# EAGLE board XOrduino2 (EAGLE 6.2)
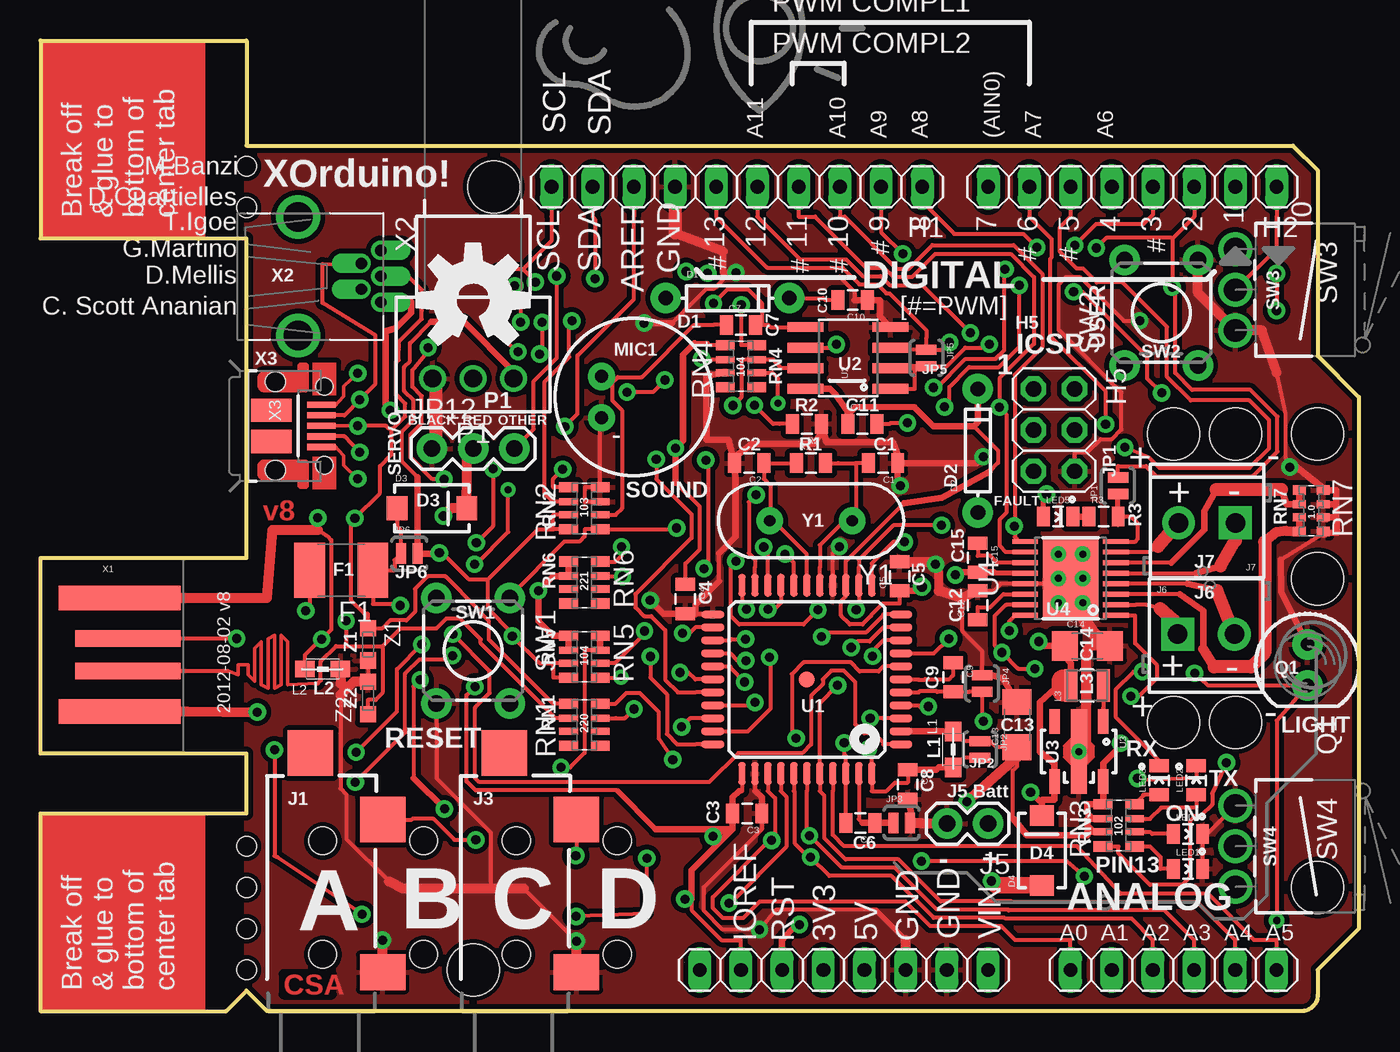
[diagram p2: board, top side]
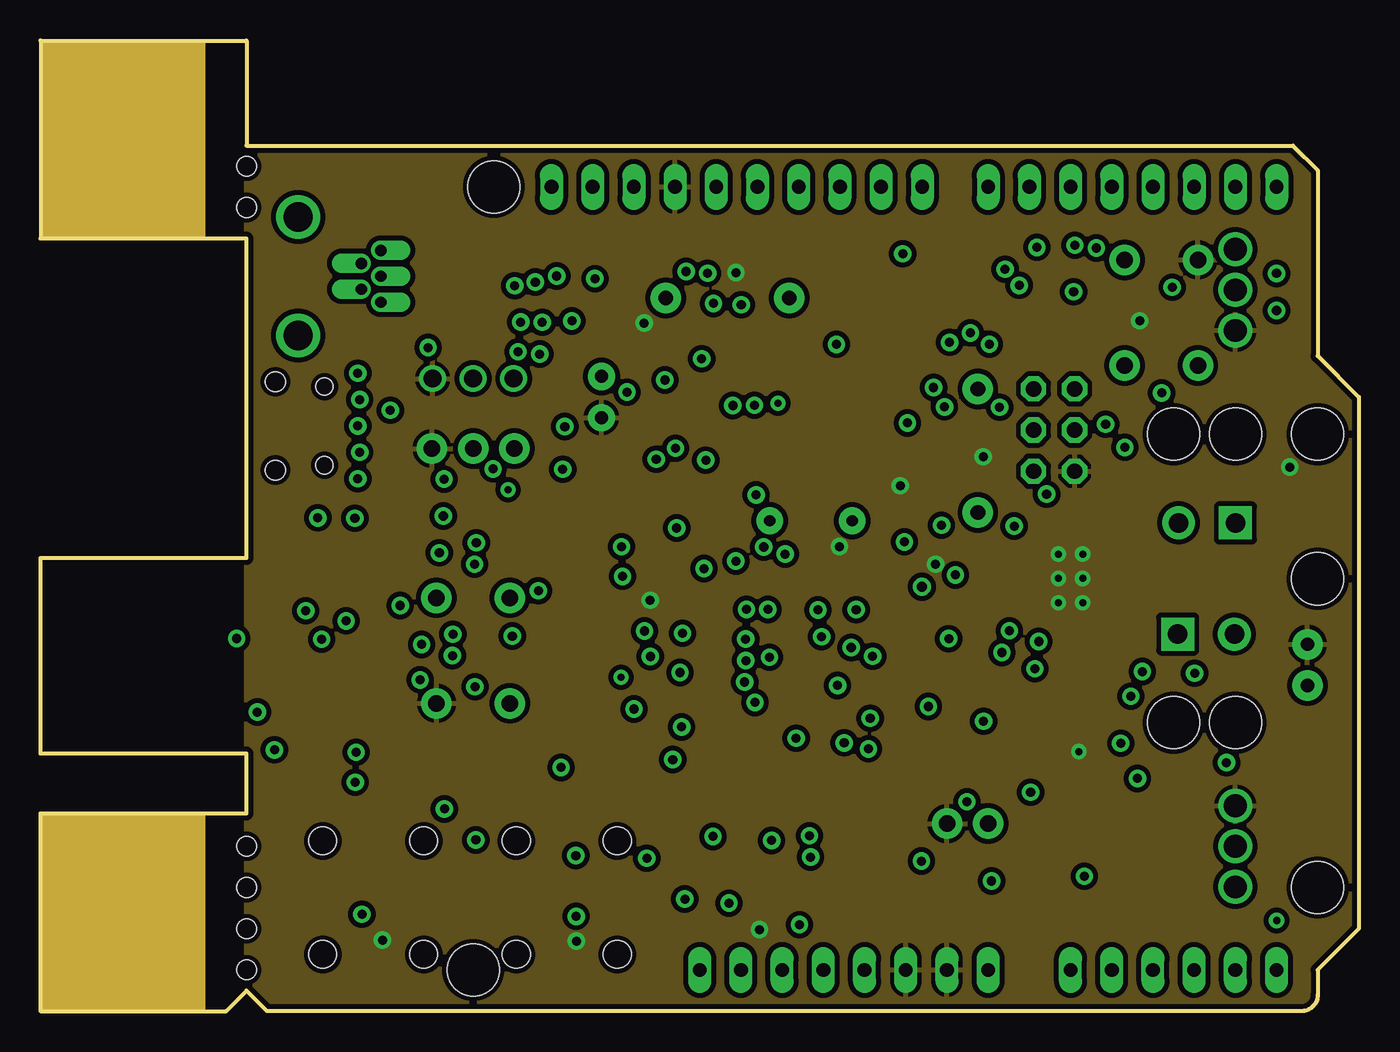
[diagram p3: board, inner layer Route2]
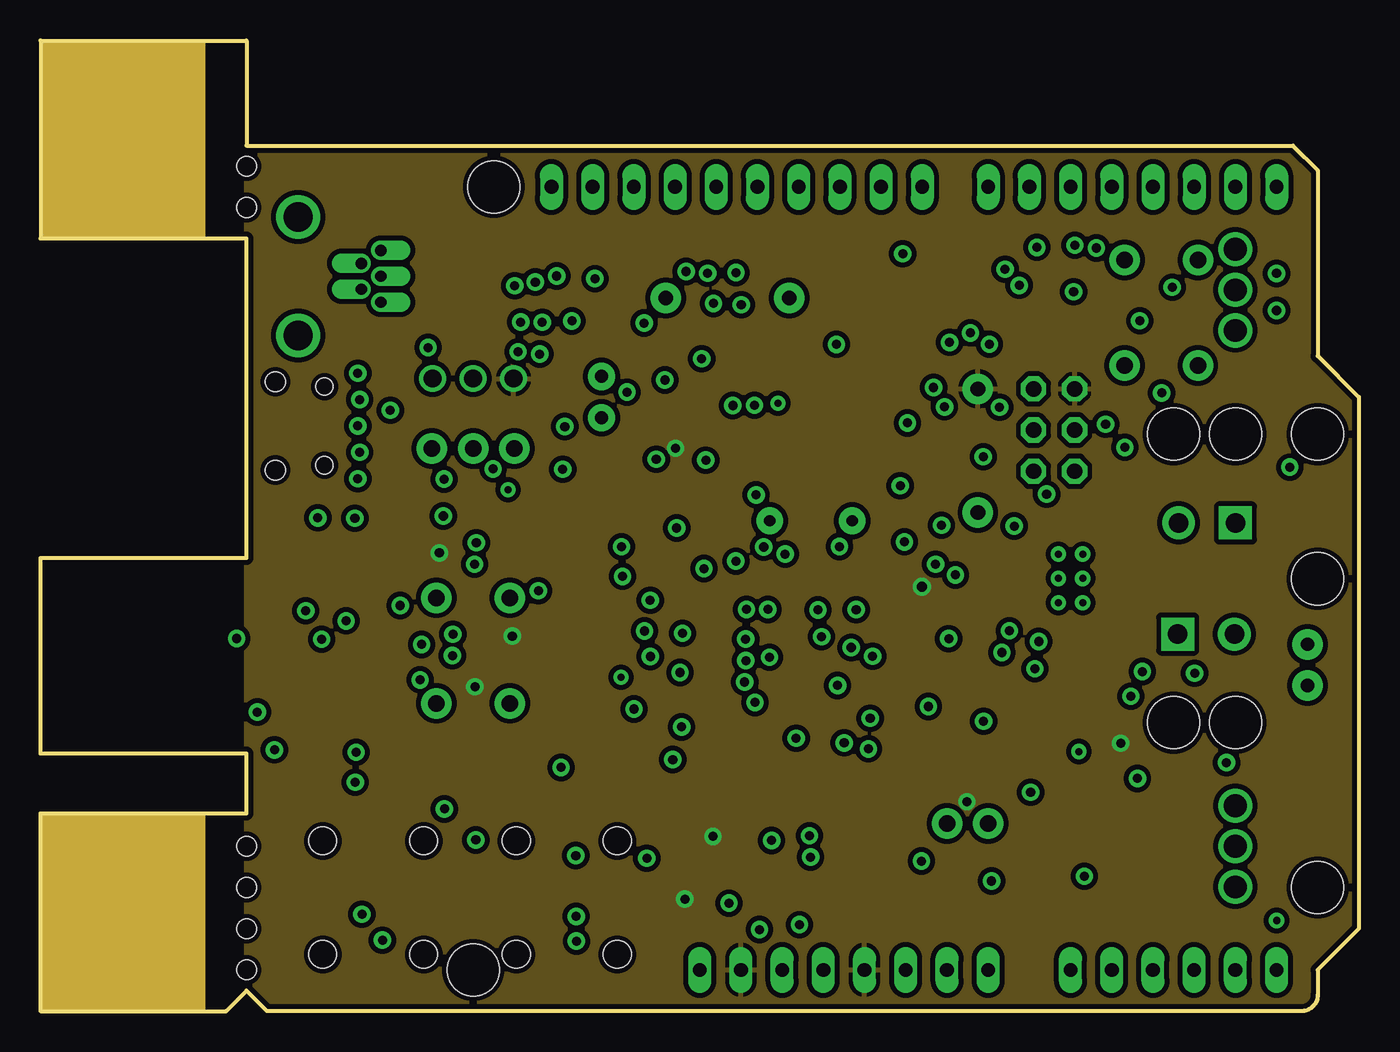
[diagram p4: board, inner layer Route15]
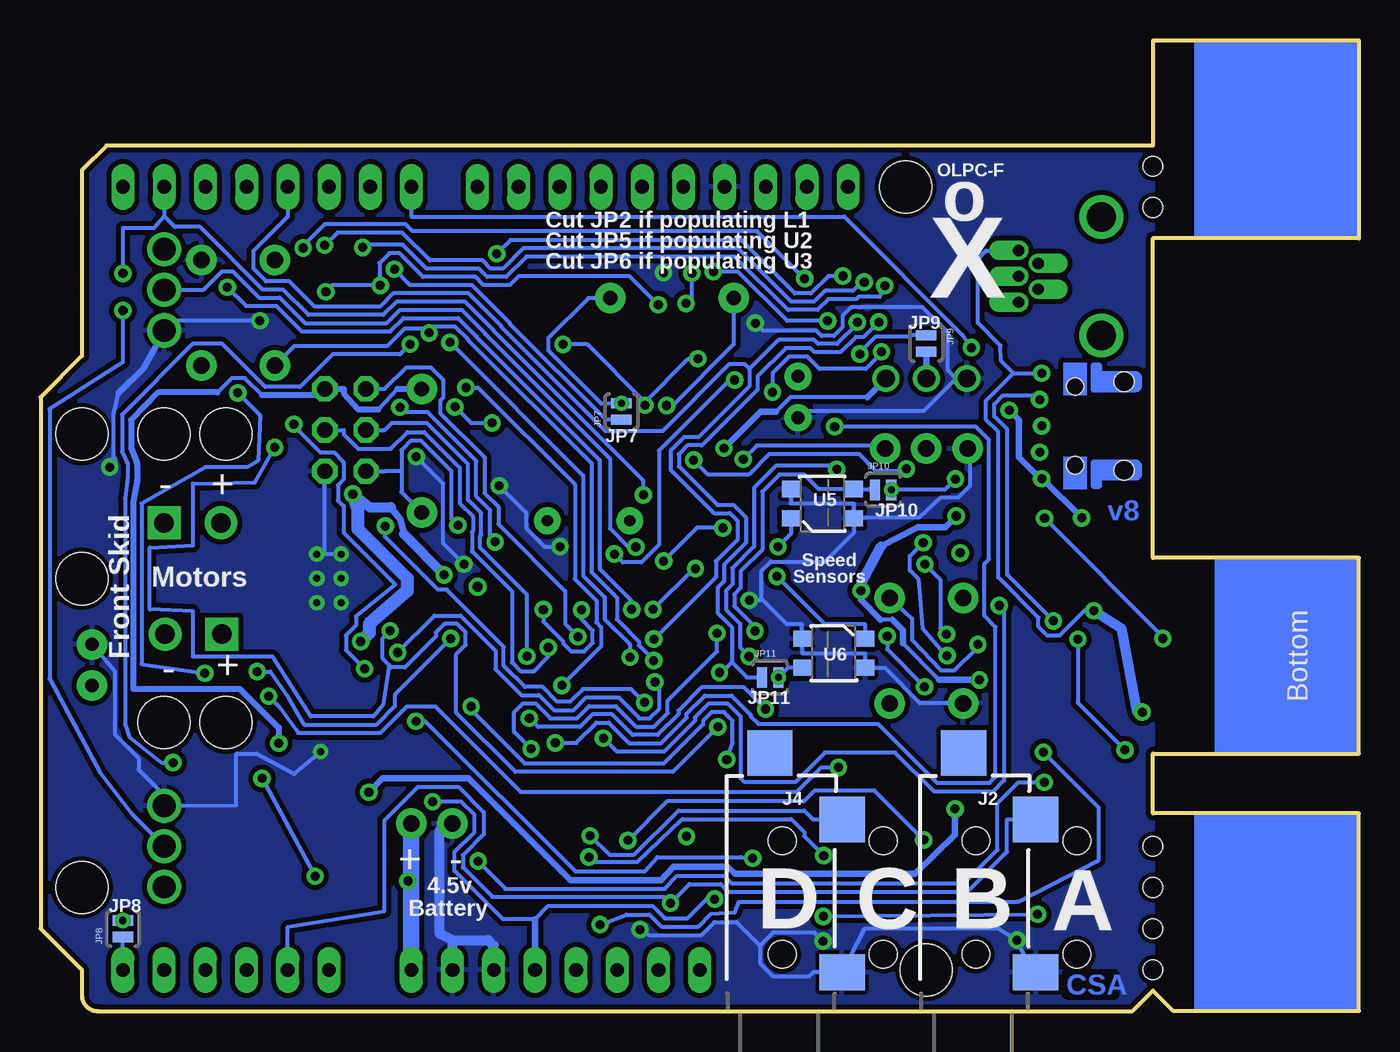
[diagram p5: board, bottom side, seen from below]

Size 81.28 x 59.82 mm. Coordinates in mm from the lower left corner, seen from the top.
Outline: 77.22,53.34 78.74,51.82 78.74,40.39 81.28,37.85 81.28,5.08 78.74,2.54 78.74,1 arc-90 77.74,0 13.97,0 12.7,1.27 11.43,0 0,0 0,12.19 12.7,12.19 12.7,15.88 0,15.88 0,27.94 12.7,27.94 12.7,47.62 0,47.62 0,59.82 12.7,59.82 12.7,53.34 77.22,53.34
Copper layers (1*2+15*16): Top 0.035mm / dielectric 0.2mm / Route2 0.035mm / dielectric 0.15mm / Route15 0.035mm / dielectric 0.2mm / Bottom 0.035mm
Design rules: minimum track width 8mil, minimum drill 20mil, track to track 8mil, track to pad 8mil, pad to pad 8mil, via to via 8mil, smd to smd 8mil, copper to edge 10mil, drill to drill 8mil, minimum pad ring 10mil, minimum via ring 10mil, stop-mask expansion 4mil, vias tented up to drill 25mil, thermal gap 10mil
Net classes: 0 default: width 0.203 mm, drill 0.406 mm, clearance 0.203 mm; 1 power: width 0.203 mm, drill 0.406 mm, clearance 0.203 mm; 2 gnd: width 0.203 mm, drill 0.406 mm, clearance 0.203 mm; 3 usbvcc: width 0.203 mm, drill 0.406 mm, clearance 0.203 mm; 4 aref: width 0.203 mm, drill 0.406 mm, clearance 0.203 mm
Holes 3.2 mm at 78.74,35.56 78.74,7.62 27.94,50.8 26.67,2.54 78.74,26.65 69.85,35.56 73.66,35.56 73.66,17.78 69.85,17.78
Holes 1.2 mm at 12.7,10.16 12.7,7.62 12.7,5.08 12.7,2.54 12.7,52.07 12.7,49.53

## Footprints (pad centres in the part's own frame; a part is rotated, then mirrored left to right if it is on the bottom)
0805 = smd 0.8 x 1.2: 1 -0.9,0; 2 0.9,0
1206 = smd 1.6 x 1.8: 1 -1.4,0; 2 1.4,0
DIODE-1N4148 = drill 0.9 pad 1.88: A -3.81,0; C 3.81,0
SMA-DIODE = smd 1.27 x 1.47: A -2.15,0; C 2.15,0
L1812 = smd 1.9 x 3.4: 1 -1.95,0; 2 1.95,0
1X10 = drill 0.85 pad 1.422 long: 1 -11.43,0; 2 -8.89,0; 3 -6.35,0; 4 -3.81,0; 5 -1.27,0; 6 1.27,0; 7 3.81,0; 8 6.35,0; 9 8.89,0; 10 11.43,0
1X08 = drill 0.85 pad 1.422 long: 1 -8.89,0; 2 -6.35,0; 3 -3.81,0; 4 -1.27,0; 5 1.27,0; 6 3.81,0; 7 6.35,0; 8 8.89,0
1X06 = drill 0.85 pad 1.422 long: 1 -6.35,0; 2 -3.81,0; 3 -1.27,0; 4 1.27,0; 5 3.81,0; 6 6.35,0
2X03 = drill 0.95 pad 1.55 octagon: 1 -2.54,-1.27; 2 -2.54,1.27; 3 0,-1.27; 4 0,1.27; 5 2.54,-1.27; 6 2.54,1.27
MJ-3523-SMT = smd 2.2 x 2.8: 1 2.4,-3.7 | smd 2.8 x 2.8: 2 11.8,-3.7; 10 15.9,0.75 | hole 1.7: 3.5,0; 10.5,0
1X02 = drill 1.016 pad 1.88: 1 0,0; 2 2.54,0
SCREWTERMINAL-3.5MM-2 = drill 1.2 pad 2.032 square: 1 0,0 | drill 1.2 pad 2.032: 2 3.5,0
SJ-2S-TRACE-NOCONFLICT = smd 0.635 x 1.27: 1 -0.508,0; 2 0.508,0
SJ-2S-BOT-TRACE-VIA-NOCONFLICT = smd 0.635 x 1.27 bottom: 1 -0.508,0; 2 0.508,0 | drill 0.432: VIA6 -0.508,0
SJ-2S-BOT-TRACE-NOCONFLICT = smd 0.635 x 1.27 bottom: 1 -0.508,0; 2 0.508,0
1X03 = drill 1.016 pad 1.88: 1 0,0; 2 2.54,0; 3 5.08,0
0805' = smd 1.2 x 1: 1 -1.1,0; 2 1.1,0
1007 = smd 2 x 0.8: 1 0,1; 2 0,-1
LED0805 = smd 0.8 x 1.2: A -0.9,0; C 0.9,0
MIC-9.7MM = drill 0.8 pad 1.676: 1 -2,1.27; 2 -2,-1.27
P091N = drill 1.1: 1 -2.5,0; 2 0,0; 3 2.5,0
LED3MM-KIT = drill 0.813 pad 1.88: A -1.27,0; K 1.27,0
CRA06S = smd 0.63 x 1.15: 1 -1.295,-0.975; 4 1.295,-0.975; 5 1.295,0.975; 8 -1.295,0.975 | smd 0.44 x 1.15: 2 -0.4,-0.975; 3 0.4,-0.975; 6 0.4,0.975; 7 -0.4,0.975
EXB38V = smd 0.6 x 0.8: 1 -1.275,-0.75; 4 1.275,-0.75; 5 1.275,0.75; 8 -1.275,0.75 | smd 0.5 x 0.8: 2 -0.4,-0.75; 3 0.4,-0.75; 6 0.4,0.75; 7 -0.4,0.75
TACTILE-PTH = drill 1.016 pad 1.88: 1 -3.251,2.261; 2 3.251,2.261; 3 -3.251,-2.261; 4 3.251,-2.261
SW-LEVER-V1-NOHOLES = drill 1.4: C 2.5,0; NC -2.5,0; NO 0,0
SW-LEVER-V2-NOHOLES = drill 1.4: C -2.5,0; NC 2.5,0; NO 0,0
TQFP44-PAD = smd 1.4 x 0.45: 1 -5.8,4; 2 -5.8,3.2; 3 -5.8,2.4; 4 -5.8,1.6; 5 -5.8,0.8; 6 -5.8,0; 7 -5.8,-0.8; 8 -5.8,-1.6; 9 -5.8,-2.4; 10 -5.8,-3.2; 11 -5.8,-4; 23 5.8,-4; 24 5.8,-3.2; 25 5.8,-2.4; 26 5.8,-1.6; 27 5.8,-0.8; 28 5.8,0; 29 5.8,0.8; 30 5.8,1.6; 31 5.8,2.4; 32 5.8,3.2; 33 5.8,4 | smd 0.45 x 1.4: 12 -4,-5.8; 13 -3.2,-5.8; 14 -2.4,-5.8; 15 -1.6,-5.8; 16 -0.8,-5.8; 17 0,-5.8; 18 0.8,-5.8; 19 1.6,-5.8; 20 2.4,-5.8; 21 3.2,-5.8; 22 4,-5.8; 34 4,5.8; 35 3.2,5.8; 36 2.4,5.8; 37 1.6,5.8; 38 0.8,5.8; 39 0,5.8; 40 -0.8,5.8; 41 -1.6,5.8; 42 -2.4,5.8; 43 -3.2,5.8; 44 -4,5.8 | smd 1 x 1: P$1 0,0
SO08 = smd 0.61 x 2.21: 1 -1.905,-2.616; 2 -0.635,-2.616; 3 0.635,-2.616; 4 1.905,-2.616; 5 1.905,2.616; 6 0.635,2.616; 7 -0.635,2.616; 8 -1.905,2.616
SOT89-5 = smd 0.65 x 1.5: 1 -1.5,-1.85; 3 1.5,-1.85; 4 1.5,1.85; 5 -1.5,1.85 | smd 1 x 5.2: 2 0,0 | drill 0.432: VIA1 0,0
PWP16 = smd 0.3 x 1.6: 1 -2.275,-2.8; 2 -1.625,-2.8; 3 -0.975,-2.8; 4 -0.325,-2.8; 5 0.325,-2.8; 6 0.975,-2.8; 7 1.625,-2.8; 8 2.275,-2.8; 9 2.275,2.8; 10 1.625,2.8; 11 0.975,2.8; 12 0.325,2.8; 13 -0.325,2.8; 14 -0.975,2.8; 15 -1.625,2.8; 16 -2.275,2.8 | smd 5 x 3.4: PPAD 0,0 | drill 0.432: VIA1 -1.5,-0.75; VIA2 0,-0.75; VIA3 1.5,-0.75; VIA4 1.5,0.75; VIA5 0,0.75; VIA6 -1.5,0.75
QRE1113GR = smd 1.1 x 1: 1 -1.95,-0.9; 2 1.95,-0.9; 3 1.95,0.9; 4 -1.95,0.9
USB-A-PCB = smd 7.5 x 1.5: 5V -0.2,-3.5; GND -0.2,3.5 | smd 6.5 x 1: USB_M 0.3,-1; USB_P 0.3,1
USB-MB-H2 = drill 0.7 pad 1.1 offset: D+ 5.1,0; D- 3.9,0.8; GND 5.1,-1.6; ID 3.9,-0.8; VBUS 5.1,1.6 | drill 1.8 pad 2.7: P$6 0,-3.65; P$7 0,3.65
USB-MICROB-VIA = smd 0.375 x 1.75: D+ 0,2.825; D- -0.65,2.825; GND 1.3,2.825; ID 0.65,2.825; VBUS -1.3,2.825 | drill 0.559 pad 1.067: D+_VIA 0,5.08; D-_VIA -1.626,5.2; GND_VIA 3.251,5.08; ID_VIA 1.626,5.2; VBUS_VIA -3.251,5.08 | smd 1.425 x 2.5: MT1 -0.963,-0.25; MT2 0.963,-0.25 | hole 1.05: -2.425,3.03; 2.425,3.03 | hole 1.2: -2.725,0; 2.725,0
HC49US = drill 0.7 pad 1.651: 1 -2.54,0; 2 2.54,0
CT/CN0603 = smd 1 x 1: 1 -1,0; 2 1,0

## Placement (x,y rotation side)
C1  18p  [0805]  51.94,33.78 180 top
C2  18p  [0805]  43.69,33.78 180 top
C3  100n  [0805]  43.56,12.19 180 top
C4  100n  [0805]  39.75,25.4 270 top
C5  100n  [0805]  52.96,26.8 90 top
C6  100n  [0805]  50.55,11.61 180 top
C7  100n  [0805]  43.18,42.29 0 top
C8  1uF  [0805]  53.47,13.97 270 top
C9  1uF  [0805]  56.26,20.57 270 top
C10  0.22uF  [0805]  50.07,43.81 180 top
C11  0.33uF  [0805]  50.67,36.2 0 top
C12  10uF  [0805]  57.78,25.02 90 top
C13  22uF  [1206]  60.2,17.65 90 top
C14  22uF  [1206]  64.54,22.51 0 top
C15  0.01uF  [0805]  57.78,27.94 270 top
D1  1N4148  [DIODE-1N4148]  42.35,43.94 0 top
D2  1N4148  [DIODE-1N4148]  57.78,34.54 90 top
D3  1A Schottkey  [SMA-DIODE]  24.13,30.99 0 top
D4  1A Schottkey  [SMA-DIODE]  61.72,9.91 90 top
F1  0ZCC0110FF2C 1.1A  [L1812]  18.54,27.18 180 top
H1  10x1F-H8.5  [1X10]  42.93,50.8 180 top
H2  8x1F-H8.5  [1X08]  67.31,50.8 180 top
H3  8x1F-H8.5  [1X08]  49.53,2.54 0 top
H4  6x1F-H8.5  [1X06]  69.85,2.54 0 top
H5  ICSP  [2X03]  62.48,35.81 270 top
J1  2.5mm  [MJ-3523-SMT]  17.4,0 90 top
J2  2.5mm  [MJ-3523-SMT]  23.62,0 90 bottom
J3  2.5mm  [MJ-3523-SMT]  29.34,0 90 top
J4  2.5mm  [MJ-3523-SMT]  35.56,0 90 bottom
J5  Batt In  [1X02]  58.42,11.56 180 top
J6  MOT R  [SCREWTERMINAL-3.5MM-2]  70.1,23.24 0 top
J7  MOT L  [SCREWTERMINAL-3.5MM-2]  73.66,30.1 180 top
JP1  N/C  [SJ-2S-TRACE-NOCONFLICT]  66.42,32.38 90 top
JP2  N/C  [SJ-2S-TRACE-NOCONFLICT]  57.91,16.13 270 top
JP3  N/C  [SJ-2S-TRACE-NOCONFLICT]  53.09,11.61 0 top
JP4  N/C  [SJ-2S-TRACE-NOCONFLICT]  58.04,20.19 270 top
JP5  N/C  [SJ-2S-TRACE-NOCONFLICT]  54.61,40.26 270 top
JP6  N/C  [SJ-2S-TRACE-NOCONFLICT]  22.73,28.19 0 top
JP7  N/C  [SJ-2S-BOT-TRACE-VIA-NOCONFLICT]  45.47,36.96 270 top
JP8  N/C  [SJ-2S-BOT-TRACE-VIA-NOCONFLICT]  76.2,5.08 270 top
JP9  N/C  [SJ-2S-BOT-TRACE-NOCONFLICT]  26.67,41.15 90 top
JP10  N/C  [SJ-2S-BOT-TRACE-VIA-NOCONFLICT]  29.34,32.13 0 top
JP11  N/C  [SJ-2S-BOT-TRACE-VIA-NOCONFLICT]  36.3,20.57 0 top
JP12  SERVO  [1X03]  24.13,34.67 0 top
L1  MH2029-300Y  [0805']  56.26,16.13 270 top
L2  MH2029-300Y  [0805']  17.4,21.08 0 top
L3  100uH  [1007]  64.52,20.07 90 top
LED1  L Yellow  [LED0805]  70.74,8.76 0 top
LED2  TX Red  [LED0805]  71.25,14.22 90 top
LED3  RX Red  [LED0805]  68.96,14.22 90 top
LED4  ON Green  [LED0805]  70.74,10.92 0 top
LED5  FAULT Red  [LED0805]  62.73,30.47 0 top
MIC1  MIC9.7MM  [MIC-9.7MM]  36.58,37.85 0 top
P1  10k  [P091N]  26.67,38.99 180 top
Q1  ALS-PT204-6C/L177  [LED3MM-KIT]  78.11,21.34 270 top
R1  1M  [0805]  47.5,33.78 0 top
R2  2.2k  [0805]  47.24,36.2 180 top
R3  1k  [0805]  65.53,30.48 0 top
RN1  22  [CRA06S]  33.53,17.65 90 top
RN2  10k  [CRA06S]  33.53,30.99 90 top
RN3  1k  [CRA06S]  66.47,11.45 90 top
RN4  100k  [CRA06S]  43.18,39.75 90 top
RN5  100k  [CRA06S]  33.53,21.84 270 top
RN6  220  [CRA06S]  33.53,26.42 270 top
RN7  1ohm 1/16W  [EXB38V]  78.34,30.84 270 top
SW1  RESET  [TACTILE-PTH]  26.67,22.23 270 top
SW2  6mm Button  [TACTILE-PTH]  69.09,43.05 90 top
SW3  LEFT BUMPER  [SW-LEVER-V1-NOHOLES]  73.66,44.45 270 top
SW4  RIGHT BUMPER  [SW-LEVER-V2-NOHOLES]  73.66,10.16 270 top
U1  ATMEGA32U4-XUAU  [TQFP44-PAD]  47.24,20.45 180 top
U2  LMV358  [SO08]  49.78,40.26 90 top
U3  NJU7261  [SOT89-5]  64.01,16 180 top
U4  DRV8833PWP  [PWP16]  63.5,26.67 90 top
U5  QRE1113GR  [QRE1113GR]  33.08,31.28 0 bottom
U6  QRE1113GR  [QRE1113GR]  32.38,22.06 180 bottom
U$5  OSHW-LOGOL  [OSHW-LOGO-L]  26.67,43.81 0 top
X1  USBPCB  [USB-A-PCB]  5.08,21.97 0 top
X2  USBMINIB  [USB-MB-H2]  15.88,45.29 0 top
X3  USBMICROB-VIA  [USB-MICROB-VIA]  14.48,36.07 270 top
Y1  16MHz  [HC49US]  47.5,30.23 180 top
Z1  CG0603MLC-05E  [CT/CN0603]  20.19,22.61 270 top
Z2  CG0603MLC-05E  [CT/CN0603]  20.19,19.3 90 top

## Tracks (layer width: path | path; a pad name or v marks a point on that pad's centre or on a via)
+5V  (via drill 0.56 pad 1.07, 0.6)
  Top 0.254: 23.24,32.9 22.29,33.85 22.29,35.75 22.99,36.45 22.99,37.65 22.42,38.22 22.42,39.71 22.77,40.07 22.77,41.17 24.09,42.49 | 40.14,6.91 40.14,6.23 41.99,4.38 43.18,4.38 H3.2 | 57.54,36.05 59.03,34.56 59.03,33.79 58.5,33.25 | 53.24,31.29 49.64,27.73 U1.14 49.64,25.56 49.35,25.26 49.35,24.38 49.89,23.83 50.67,23.83 51.2,24.36 51.2,24.41 51.91,25.12 52.96,25.12 C5.1 | 59.94,11.9 59.94,14.82 60.2,15.07 60.2,15.65 C13.1 58.92,16.25 58.53,16.64 JP2.1 56.9,16.64 56.39,17.14 | L1.1 56.3,17.23 56.39,17.14 | 43.05,13.57 43.24,13.57 U1.34 | 31.6,29.69 31.6,30.59 RN2.7 | RN2.8 31.6,29.69 | RN3.7 65.02,11.05 64.94,11.05 | 64.88,11.85 RN3.6 | RN4.5 41.25,41.05 41.13,41.16 40.33,41.16 | C4.1 39.75,27.58 40.65,28.48 40.65,31.08 39.15,32.58 | 65.51,13.62 U3.5 | 56.39,17.14 55.73,17.14 55.63,17.25 | RN5.3 31.6,21.44 | 31.6,21.44 30.76,21.44 v29.08,23.12 29.08,23.31 27.6,24.79 27.6,26.63 | 31.6,21.44 31.6,20.55 RN5.4 | 24.81,28.19 26.38,26.63 27.6,26.63 | 27.6,26.63 30.66,29.69 31.6,29.69 | 35.53,13.6 26.83,13.6 26.26,14.17 26.26,19.48 v26.78,20
  Top 0.305: 37.92,11.21 35.53,13.6 | 24.81,28.19 v24.59,28.25
  Top 0.356: 55.06,36.05 53.88,37.23 50.24,37.23 49.79,36.78
  Top 0.406: 23.24,32.9 JP6.2 24.81,28.19 | 24.09,42.49 26.1,42.49 29.17,39.42 P1.1 | 42.66,11.21 40.14,8.69 40.14,6.91 v39.72,6.91 | 58.5,33.25 55.58,31.63 53.24,31.29 | 59.94,11.9 60.8,10.84 64.53,10.84 64.54,11.05 65.02,11.05 | 43.05,13.57 42.66,13.17 C3.2 42.66,11.21 | 64.94,11.05 64.54,11.45 64.54,11.85 64.88,11.85 64.54,12.19 64.54,12.74 RN3.5 65.51,13.02 65.51,13.62 | U2.8 48.65,38.35 48.99,38.02 49.75,36.96 C11.1 49.79,36.7 49.79,36.78 | U3.5 65.51,15.28 66.59,16.37 v66.59,16.51 | 55.63,17.25 U1.2 | D2.C 57.78,36.29 57.54,36.05 55.06,36.05 | 40.33,41.16 39.61,40.44 39.61,35.16 v39.15,34.7 39.15,32.58 | 42.66,11.21 42.27,11.21 | 42.27,11.21 37.92,11.21 | v41.45,10.77 42.27,11.21 | v54.33,26.16 54.36,25.91 52.83,25.91
  Top 0.61: v57.11,12.91 60.2,15.65
  Bottom 0.254: v39.72,6.91 40.22,6.91 41.41,5.72 42.79,5.72 43.56,6.49 49.98,6.49 50.8,5.67 52.78,5.67 55.76,8.65 55.76,9.81 54.53,11.03 54.53,12.1 55.35,12.91 v57.11,12.91 | v57.11,12.91 | 67.63,37.96 68.68,39.01 69.49,39.01 70.37,38.14 | 60.45,37.08 59.28,38.35 | v29.08,23.12 29.08,22.3 v26.78,20 | 30.31,37.85 35.04,37.85 35.93,36.95
  Bottom 0.356: 67.63,37.96 64.14,37.96 H5.2 62.59,38.35 62.59,38.08 61.7,37.08 60.45,37.08 | 70.37,38.14 74.03,38.14 75.69,36.42 75.69,34.7 75.34,33.73 75.34,32.72 75.56,31.39 75.56,19.86 69,19.86 66.59,17.48 v66.59,16.51 | 59.28,38.35 D2.C
  Bottom 0.406: H3.5 50.8,5.67 | P1.1 30.31,37.85 | 35.93,36.95 36.89,36.95 v39.15,34.7
  pour Route15 (isolate 0.305): 12.7,1.27 12.7,52.07 13.97,53.34 77.47,53.34 78.74,52.07 78.74,40.64 81.28,38.1 81.28,5.08 78.74,2.54 78.74,1.27 77.47,0 15.24,0
A0  (via drill 0.56 pad 1.07)
  Top 0.254: J1.2 22.88,11.8 22.96,11.88 24.19,11.88 25.52,10.55 v26.84,10.55 | U1.36 44.84,13.57 45.28,13.13 45.28,10.73 v45.07,10.52 44.94,10.52 41.45,7.04 41.45,6.35 42.06,5.74 43.31,5.74 44.32,6.75 53.34,6.75 54.85,5.24 59.23,5.24 60.09,4.38 63.5,4.38 H4.1
  Bottom 0.254: v26.84,10.55 29.87,13.59 33.56,13.59 34.22,12.92 42.66,12.92 v45.07,10.51 v45.07,10.52
A1  (via drill 0.56 pad 1.07)
  Top 0.254: v42.44,6.66 42.52,6.66 45.98,10.12 45.98,13.22 45.64,13.57 U1.37
  Bottom 0.254: J2.2 21.7,11.8 21.7,9.82 24.14,7.37 38.89,7.37 39.34,7.82 41.27,7.82 v42.44,6.66 42.83,7.05 53.43,7.05 55.23,8.86 55.23,9.61 53.96,10.89 53.96,12.26 55.52,13.82 58.02,13.82 60.07,11.76 60.07,6.17 66.04,5.19 H4.2
A2  (via drill 0.56 pad 1.07)
  Top 0.254: H4.3 68.58,4.38 67.26,5.7 59.49,5.7 59.44,5.75 55.06,5.75 52.47,8.34 48.63,8.34 v47.47,9.49 47.35,9.49 46.49,10.36 46.49,13.52 46.44,13.57 U1.38 | v33,9.59 33,9.98 33.04,10.02 J3.2
  Bottom 0.254: v47.47,9.49 47.07,9.2 44.48,9.2 41.73,11.84 34.99,11.84 34.19,11.04 34.19,10.78 v33,9.59
A3  (via drill 0.56 pad 1.07)
  Top 0.254: H4.4 71.12,4.38 69.29,6.21 59.7,6.21 59.65,6.25 55.27,6.25 52.68,8.85 49.42,8.85 47.45,10.82 v47.41,10.82 47.24,10.98 47.24,13.57 U1.39
  Bottom 0.254: J4.2 33.64,11.8 34.2,12.35 41.94,12.35 44.68,9.65 46.2,9.65 v47.41,10.82
A4  (via drill 0.56 pad 1.07)
  Top 0.254: v49.14,20.07 48.04,18.98 48.04,15.73 U1.40 48.04,13.57 48.32,13.29 48.32,10.66 49.63,9.35 52.89,9.35 55.48,6.76 59.86,6.76 59.91,6.72 71.32,6.72 73.66,4.38 H4.5 | v55.06,38.44 55.27,38.44 57.03,40.19 58.88,40.19 59.41,40.73 59.41,45.68 v59.47,45.73
  Bottom 0.254: v55.06,38.44 | v55.06,38.44 54.32,38.44 48.34,32.46 48.34,26.63 47.02,25.31 47.02,23.96 46.73,23.67 46.73,22.48 v49.14,20.07 | JP7.2 46.43,36.45 52.35,42.37 52.35,42.42 54.69,44.75 58.49,44.75 v59.47,45.73
A5
  Top 0.254: H4.6 76.2,4.38 74.82,4.38 71.98,7.22 66.59,7.22 63.9,10.17 49.54,10.17 48.84,10.86 48.84,13.57 U1.41
  Bottom 0.254: H4.6 JP8.2
AGND
  Top 0.254: U1.43 50.44,11.83 50.66,11.61
  Top 0.406: 50.66,11.61 C6.1 JP3.1
AREF  (via drill 0.56 pad 1.07)
  Top 0.254: v49.55,16.54 49.55,15.83 49.64,15.73 U1.42 49.64,12.59 49.65,12.59 C6.2 | v32.32,36.03 33.1,36.81 33.1,40.41 36.58,43.88 36.58,48.96 H1.8
  Bottom 0.254: v49.55,16.54 48.26,16.54 47.01,17.79 46.25,17.79 44.99,16.53 43.02,16.53 41.45,18.1 41.45,18.32 40.32,19.45 38.67,19.45 37.51,18.28 37.51,18.18 37.03,17.7 29.64,17.7 26.01,14.07 22.77,14.07 22.41,14.44 22.41,23.68 23.09,24.35 23.09,27.57 22.8,27.86 22.8,35.22 23.62,36.03 v32.32,36.03
AVCC  (via drill 0.56 pad 1.07)
  Top 0.254: v51.04,16.17 51.04,15.93 51.24,15.73 U1.44 51.24,14.12 51.24,13.57 52.16,13.57 52.69,14.09 53.47,14.09 C8.1 | v39.58,23.29 40.01,23.29 40.36,23.65 U1.24 | L1.2 56.3,15.03 56.9,15.62 57.73,15.62 JP2.2
  Top 0.406: L1.2 55.38,15.03 55.22,14.87 54.45,14.87 C8.1
  Bottom 0.254: v51.04,16.17 52.09,17.22 52.09,18.41 51.53,18.97 50.77,18.97 49.84,18.04 48.22,18.04 47.46,18.8 45.83,18.8 44.57,17.54 43.45,17.54 42.62,18.37 42.62,19.12 39.58,22.17 v39.58,23.29
D0/RX  (via drill 0.56 pad 1.07)
  Top 0.254: v44.58,28.61 44.84,28.34 44.84,27.33 U1.20 | SW3.NO 76.2,46.99 76.2,48.96 H2.1
  Bottom 0.254: SW3.NO 71.23,44.45 70.08,45.6 69.43,45.6 67.8,43.97 66.54,43.97 64.97,42.4 59.94,42.4 59.11,43.23 55.32,43.23 53.88,41.78 53.88,41.74 46.19,34.05 46.19,29.75 45.05,28.61 v44.58,28.61
D1/TX  (via drill 0.56 pad 1.07)
  Top 0.254: v44.11,31.82 43.67,31.37 43.67,28.23 44.04,27.85 44.04,27.33 U1.21 | v76.2,45.47 v76.2,43.18
  Bottom 0.254: v44.11,31.82 44.11,32.7 53.37,41.95 53.37,41.99 55.11,43.73 59.32,43.73 60.15,42.91 64.76,42.91 66.33,44.48 67.58,44.48 71.45,48.34 73.01,48.34 | 73.01,48.34 | 73.01,48.34 73.66,48.99 | 73.66,48.99 74.3,48.26 76.2,48.26 v76.2,45.47 | SW4.NO 75.58,12.08 77.65,14.75 80.72,20.48 80.72,37.12 76.2,40.01 v76.2,43.18 | H2.2 73.66,48.99
D2/SDA  (via drill 0.56 pad 1.07)
  Top 0.254: 69.77,47.61 69.71,47.66 65.72,47.66 v65.08,47.03 | v34.17,45.14 34.17,48.82 34.04,48.96 H1.9 | H2.3 71.12,48.96 69.77,47.61 | U1.19 45.64,25.17 45.24,24.76 v44.84,24.76 | JP1.2 66.42,33.59 68.15,33.59 68.78,32.97 74.73,32.97 76.25,34.49 76.25,36.63 74.59,38.29 70.99,38.29 69.95,39.33 69.95,44.44 v69.77,44.62 69.77,47.61
  Bottom 0.254: v69.77,44.62 68.61,43.46 66.75,43.46 65.18,41.89 59.73,41.89 58.9,42.72 55.53,42.72 54.38,41.57 54.38,41.53 46.82,33.96 46.82,27.27 44.84,25.28 v44.84,24.76 | v34.17,45.14 37.1,48.07 58.35,48.07 58.78,48.49 63.76,48.49 65.08,47.17 v65.08,47.03 | v65.08,47.03
D3/SCL  (via drill 0.56 pad 1.07)
  Top 0.254: v45.9,28.17 46.44,27.63 46.44,27.33 46.44,26.66 U1.18 | v63.76,47.2 65.08,48.51 68,48.51 68.58,49.09 H2.4 | 29.76,45.74 29.41,45.74 28.15,45.69 28.15,41.73 v29.44,40.64 | 29.76,45.74 30.5,44.99 v30.5,44.93 | 29.76,45.74 31.5,47.47 31.5,48.96 H1.10 | v38.49,38.9 37.74,38.15 v36.16,38.15
  Bottom 0.254: v38.49,38.9 38.81,38.9 43.16,34.54 43.16,28.73 44.24,27.65 45.38,27.65 v45.9,28.17 | v30.5,44.93 30.66,44.93 31.2,44.39 32.92,44.39 33.59,43.72 34.99,43.72 38.27,47.01 51.53,47.01 52.78,45.76 53.53,45.76 54.04,46.27 57.28,46.27 58.99,47.99 62.98,47.99 v63.76,47.2 | v29.44,40.64 29.44,40.54 30.4,39.58 33.25,39.58 34.01,40.34 35.13,40.34 36.16,39.32 v36.16,38.15
D4  (via drill 0.56 pad 1.07)
  Top 0.254: v43.47,22.93 42.61,22.93 42.52,22.85 U1.25 | v30.93,42.46 30.93,40.65 v30.78,40.5
  Bottom 0.254: 37.58,39.58 37.58,38.52 40.72,35.38 41.6,35.38 42.44,34.55 42.44,33.37 39.76,30.69 38.78,30.69 38.31,30.22 38.31,29.07 39.64,27.73 39.64,26.75 v43.47,22.93 | 37.58,39.58 37.86,39.86 38.82,39.86 42.93,35.75 46.45,35.75 52.86,42.16 52.86,42.2 54.9,44.24 59.53,44.24 60.36,43.41 64.38,43.41 65.95,44.98 67.38,44.98 68.15,45.76 68.15,46.85 66.04,48.96 | 66.04,48.96 | v30.93,42.46 30.93,42.36 32.17,41.12 33.35,41.12 33.6,41.38 35.78,41.38 37.58,39.58 | v30.78,40.5 30.78,40.6 29.82,41.55 27.79,41.55 27.69,41.66 JP9.2 | H2.5 66.04,48.96
D5*  (via drill 0.56 pad 1.07)
  Top 0.203: v66.85,34.75 68.34,34.13
  Top 0.254: U4.16 60.1,24.39 59.73,24.02 v59.73,23.44 | v39.52,17.52 40.05,18.05 U1.31 | 68.34,34.13 68.99,33.48 74.52,33.48 75.74,34.7 75.74,36.42 74.52,37.64 70.91,37.64 69.44,39.11 69.44,42.17 66.69,44.92 65.11,44.92 64.28,45.76 63.88,45.76 62.85,46.79 62.85,48.31 63.5,48.96 H2.6
  Bottom 0.254: 59.78,21.32 60.18,21.73 60.18,22.98 v59.73,23.44 | v39.52,17.52 42.3,14.74 52.01,14.74 55.66,18.4 55.66,22 55.08,22.58 55.08,23.34 55.61,23.88 56.37,23.88 56.9,23.34 56.9,23.1 58.82,21.19 59.65,21.19 59.78,21.32 | 59.78,21.32 59.97,20.12 60.17,18.88 60.76,18.16 64.62,18.16 66.98,21.84 71.88,21.84 71.88,24.64 74.55,24.77 74.55,28.57 71.88,28.7 71.88,32.51 68.07,32.59 v66.85,34.75
D6*  (via drill 0.56 pad 1.07)
  Top 0.254: v61.3,21.11 60.27,21.11 v59.27,22.11 58.81,22.56 58.81,24.34 59.52,25.05 U4.15 | v43.41,20.29 42.52,21.17 42.52,21.25 U1.27 | v65.66,36.17 65.66,38.19 62.27,41.59 62.27,46.39 62.34,46.47 62.34,47.58 60.96,48.96 H2.7
  Bottom 0.254: v65.66,36.17 65.66,36.07 64.03,34.44 63.2,34.44 62.58,33.82 62.58,32.78 62.95,32.42 62.95,31.47 62.59,31.12 62.59,29.47 59.44,26.31 59.44,26.29 61.83,24.33 61.83,23.78 62.45,23.16 62.45,22.25 v61.3,21.11 | v59.27,22.11 56.99,24.38 55.4,24.38 53.24,22.22 53.24,21.09 51.63,19.48 50.56,19.48 49.63,18.56 48.42,18.56 47.65,19.33 45.64,19.33 44.36,18.05 43.73,18.05 43.13,18.65 43.13,20 v43.41,20.29
D7  (via drill 0.56 pad 1.07)
  Top 0.254: v24.87,32.79 24.14,32.79 22.8,34.13 22.8,35.54 23.49,36.24 23.49,37.91 22.93,38.47 22.93,39.5 23.83,40.6 v23.89,40.9 | v25.42,23.23 27.7,20.96 27.7,19.62 26.8,18.73 26.8,14.34 27.04,14.11 41.22,14.11 43.02,15.91 46.96,15.91 47.5,16.45 47.5,19.43 48.22,20.15 48.22,20.45 48.76,20.99 49.52,20.99 50.23,20.27 50.23,17.68 50.79,17.12 51.38,17.12 51.96,16.54 51.96,16.45 U1.1 | v26.76,27.54 26.84,27.54 28.83,29.53 JP10.VIA6
  Bottom 0.254: v23.89,40.9 24.44,41.66 31.73,48.96 58.42,48.96 H2.8 | JP10.VIA6 28.79,32.17 25.49,32.17 v24.87,32.79 | v26.76,27.54 25.8,26.59 25.8,23.61 v25.42,23.23
D_M  (via drill 0.56 pad 1.07)
  Top 0.203: 17.09,20.2 15.24,20.12 15.24,22.76 14.83,23.16 14.83,20.12 14.43,19.91 14.43,23.16 14.02,22.96 14.02,19.91 13.61,20.12 13.61,22.76 13.21,22.35 13.21,20.32 12.8,20.73 12.8,21.34 12.19,21.34 12.19,20.73 11.55,20.97
  Top 0.254: 18.84,22.5 21.08,22.5 | 17.09,20.2 17.28,20.39 17.28,21.56 18.22,22.5 18.84,22.5 | v18.84,24.05 18.84,22.5 | X3.D-_VIA 20.65,38.67 20.65,41.65 17.38,43.65 17.38,46.03 X2.D- | 21.08,22.5 21.08,19.61 20.66,19.18 20.19,19.18 Z2.1 | 21.08,22.5 22.16,23.58 24.39,23.58 25,24.19 25.86,24.19 27.14,22.91 27.14,22.66 31.6,18.21 31.6,18.05 RN1.6 | X1.USB_M 11.55,20.97
  Bottom 0.254: v18.84,24.05 21.68,26.89 21.68,35.86 22.48,36.66 22.48,37.42 21.94,37.95 19.94,37.95 X3.D-_VIA
D_P  (via drill 0.56 pad 1.07)
  Top 0.254: 21.66,35.84 21.66,34.32 20.92,33.59 20.92,31.92 v19.38,30.38 19.16,30.16 19.16,25.3 19.97,24.49 20.19,24.49 Z1.1 21.07,23.61 21.55,24.09 22.56,24.09 23.09,24.61 23.09,26.02 23.86,26.8 24.96,26.8 26.98,24.78 26.98,24.7 27.65,24.02 27.65,22.9 31.6,18.95 RN1.5 | 21.66,35.84 | 21.66,35.84 21.59,35.9 21.46,35.9 21.29,36.07 X3.D+_VIA | 21.66,35.84 22.48,36.66 22.48,37.44 21.91,38.01 21.91,39.97 22.08,40.14 22.1,41.27 23.5,42.67 23.5,43.18 23.5,44.45 22.7,45.25 22.08,45.25 X2.D+ | v12.09,22.97 9.02,22.97 9.01,22.97 X1.USB_P
  Bottom 0.254: v12.09,22.97 11.97,22.97 v19.38,30.38
GND  (via drill 0.56 pad 1.07)
  Top 0.254: JP12.1 24.37,34.71 | 51.47,6.25 45.33,6.25 v44.32,5.03 42.06,5.03 40.89,6.19 40.89,7.64 44.46,11.21 C3.1 | v49.26,28.63 48.84,28.22 U1.15 | v67.77,42.54 66.77,42.54 64.07,45.25 63.23,45.25 62.77,44.79 62.77,41.98 66.64,38.12 66.64,35.85 66.04,35.25 65.36,35.25 64.55,34.44 63.75,34.44 H5.6 | 42.07,45.27 49.26,45.27 50.19,44.34 50.19,43.81 | 44.07,13.57 44.04,13.57 U1.35 | C4.2 40.31,24.5 40.36,24.45 U1.23 | U4.VIA5 U4.PPAD | RN2.3 33.55,31.39 33.55,32.28 RN2.4 34.5,36.5 MIC1.2 | RN7.6 79.48,30.44 79.29,30.25 79.09,30.25 | 76.45,27.81 79.12,29.46 | 48.12,35.61 48.12,35.69 R2.1 | C2.2 42.81,34.04 | JP3.2 53.59,12.16 | C1.1 52.82,33.78 52.82,34.33 | C12.2 58.77,25.92 59.19,26.34 U4.13 62.42,26.34 | U3.VIA1 64.49,16.48 | LED1.C LED4.C 71.92,10.92 SW4.C | Z1.2 Z2.2 | U4.VIA6 62.75,26.02 62.42,26.34 | 62.42,26.34 U4.VIA5 | U4.VIA5 U4.VIA4 | U4.VIA3 U4.VIA2 U4.VIA1 | 79.48,32.12 79.24,32.12 RN7.8 | 38.94,42.41 41.07,44.53 41.53,44.53 42.07,45.07 42.07,45.27 | 42.07,45.27 42.07,45.52 | 77.18,33.74 76.76,34.08 76.76,36.8 76.2,39.37 | 18.48,19.48 18.48,13.73 18.85,13.36 18.85,10.64 21.49,8 | 29.79,7.57 v33.04,4.32 | 56.8,25.46 56.8,23.44 58.04,22.2 JP4.1 | 55.03,27.7 v55.18,27.54 | 52.94,32.38 v53,32.38 | SW1.4 24.41,14.36 27.75,11.02 27.75,7.57 | 41.84,26.51 41.84,28.23
  Top 0.305: 53.34,4.38 51.47,6.25
  Top 0.406: v37.59,25.32 38.41,24.5 C4.2 | 44.07,13.57 44.46,13.17 C3.1 | RN4.7 41.05,39.15 41.05,35.22 42.42,35.22 C2.2 42.85,32.82 42.85,29.25 41.84,28.23 | 79.87,31.24 79.87,30.44 | RN7.7 79.87,31.24 | 79.87,31.24 79.87,32.12 79.48,32.12 | 79.48,30.44 79.87,30.44 | Q1.A 76.51,25.83 76.45,27.81 | 79.12,29.46 79.94,29.49 79.87,30.44 | 48.12,35.61 47.7,34.98 43.87,34.98 43.06,34.37 42.81,34.04 | 53.59,12.16 53.67,12.29 C8.2 | 50.19,43.81 C10.1 51.75,43.81 51.75,42.81 U2.4 | v37.21,42.41 38.94,42.41 | 42.07,46.82 42.07,45.52 v42.88,45.52 | 79.24,32.12 77.18,33.74 v77.01,33.53 | 52.82,33.78 52.82,33.01 52.94,32.38 | C1.1 57.73,33.78 v58.12,34.17 | 52.82,34.33 52.53,35.07 48.45,35.07 R2.1 | 40.36,24.45 40.36,25.04 41.84,26.51 | C13.2 59.33,20.52 58.52,20.73 JP4.1
  Top 0.559: 55.37,25.91 55.37,27.08 v55.18,27.54
  Top 0.61: L2.2 18.5,20.2 18.85,19.85 | J3.1 v33.04,4.32 | 64.49,16.48 64.49,22.24 64.75,22.51 C14.2 | J5.2 54.34,11.56 54.29,11.61 JP3.2 | H3.6 53.34,4.38 | Z2.2 19.31,20.3 18.85,19.85 | SW2.4 71.35,44.26 SW3.C 75.3,41.95 76.2,39.37 | 42.07,46.82 39.12,47.94 | 18.85,19.85 18.48,19.48 | 29.79,7.57 27.75,7.57 22.32,7.57 21.49,8 | C5.2 55.03,27.7 | J1.1 v21.07,4.38 | 79.12,29.46 RN7.5 | C12.2 56.8,25.46 55.37,25.91
  Top 0.813: 24.37,34.71 24.38,38.61 P1.3 | H1.7 39.12,47.94 | U4.VIA1 arc60 65.41,22.86
  Bottom 0.203: 34.33,22.94 34.34,22.94 U6.2 | U5.2 | U6.4 | U5.4
  Bottom 0.254: 24.84,38.99 25.35,39.5 25.35,41.84 26.9,43.38 30.77,43.38 30.78,43.38 31.31,43.38 31.84,42.84 31.84,42.16 32.38,41.62 33.13,41.62 33.45,41.94 36.75,41.94 v37.21,42.41 | v44.32,5.03 43.77,4.69 40.53,4.69 39.74,5.49 38.37,5.49 36.93,4.04 | v53,32.38 51.34,30.73 51.34,29.78 50.2,28.63 v49.26,28.63 | 36.83,25.42 36.93,25.32 v37.59,25.32 | Q1.A 76.7,20.95 76.7,17.06 75.23,15.6 75.23,14.88 73.66,13.31 SW4.C 69.22,12.7 69.22,15.88 67.94,15.88 65.63,14.63 U3.VIA1 | H3.6 53.34,4.05 | U6.4 30.43,22.04 34.29,22.04 34.33,22.08 34.33,22.94 34.33,23.84 35.25,23.84 36.83,25.42 | U5.4 35.03,31.3 31.17,31.3 31.13,31.26 U5.2 31.13,29.94 | 31.13,29.94 31.13,29.5 32.92,27.71 36.26,27.71 36.83,27.13 36.83,25.42 | U6.4 | U6.4 29.24,21.16 27.05,18.97 SW1.4 | 36.93,4.04 36.93,2.96 36.12,2.15 33.89,2.15 33.64,2.4 J4.1 30.48,5.08 22.23,5.08 v21.07,4.38 20.47,3.04 J2.1 | 24.84,38.99 P1.3 | v33.04,4.32 33.56,4.84 36.13,4.84 36.93,4.04 | MIC1.2 34.14,37.01 26.82,37.01 24.84,38.99 | 63.75,28.17 H5.6 | U4.VIA4 63.75,28.17 | 63.75,28.17 U4.VIA3 | v67.77,42.54 73.07,42.54 SW3.C | 31.13,29.94 30.72,30.43 27.1,30.43 25.79,31.66 24.71,31.66 23.96,32.41 23.96,34.5 JP12.1 | v55.18,27.54 56.46,28.82 56.46,32.51 v58.12,34.17 | 76.76,34.04 76.76,36.83 76.45,38.1
  Bottom 0.406: v77.01,33.53 76.71,33.53 76.76,34.04 | 76.45,38.1 74.93,39.62 73.66,41.91
  Bottom 0.61: 55.88,4.38 53.67,4.38 53.34,4.05 | 55.88,4.38 56.68,4.77 56.68,11.17 J5.2 | H3.7 55.88,4.38
  pour Bottom (isolate 0.305): 12.7,1.27 12.7,52.07 13.97,53.34 77.47,53.34 78.74,52.07 78.74,40.64 81.28,38.1 81.28,5.08 78.74,2.54 78.74,1.27 77.47,0 15.24,0
  pour Route2 (isolate 0.305): 12.7,1.27 12.7,52.07 13.97,53.34 77.47,53.34 78.74,52.07 78.74,40.64 81.28,38.1 81.28,5.08 78.74,2.54 78.74,1.27 77.47,0 15.24,0
  pour Top (isolate 0.305): 12.7,1.27 12.7,52.07 13.97,53.34 77.47,53.34 78.74,52.07 78.74,40.64 81.28,38.1 81.28,5.08 78.74,2.54 78.74,1.27 77.47,0 15.24,0
HWB  (via drill 0.56 pad 1.07)
  Top 0.254: v37.59,21.86 37.59,20.55 38.61,19.54 38.61,17.09 39.25,16.45 40.36,16.45 40.74,16.45 40.76,16.45 40.98,16.45 U1.33 | RN2.5 31.6,32.28 31.6,32.8 v32.19,33.4
  Bottom 0.254: v32.19,33.4 32.4,33.6 35.95,33.6 37.29,32.26 37.29,28.65 38.63,27.31 38.63,26.3 39.02,25.9 39.02,24.75 38.15,23.88 38.15,22.42 v37.59,21.86
IO8  (via drill 0.56 pad 1.07)
  Top 0.254: v39.42,20.87 39.94,20.87 40.36,20.45 41.03,20.45 U1.28 | v61.43,47.07 60.59,47.91 56.33,47.91 54.36,49.88 H1.1 | v29.23,44.7 29.61,43.96 v29.61,42.47
  Bottom 0.254: 38.66,21.51 39.3,20.87 v39.42,20.87 | v29.61,42.47 29.62,42.47 30.55,41.55 31.02,41.55 31.96,40.61 33.56,40.61 33.82,40.87 35.33,40.87 37.07,39.13 37.07,38.31 40.51,34.87 41.39,34.87 41.93,34.34 41.93,33.58 39.55,31.2 38.57,31.2 37.8,30.43 37.8,28.86 39.13,27.52 39.13,26.51 39.53,26.11 39.53,24.54 38.66,23.67 38.66,21.51 | 38.66,21.51 37.73,20.57 37.15,20.57 JP11.2 | v29.23,44.7 29.55,44.02 30.86,44.02 30.99,43.88 32.71,43.88 33.38,43.21 35.2,43.21 38.48,46.5 51.32,46.5 52.57,45.26 53.74,45.26 54.26,45.77 57.49,45.77 58.96,47.23 61.26,47.23 v61.43,47.07
IO9*  (via drill 0.56 pad 1.07)
  Top 0.254: v37.96,34.02 37.96,32.8 40.14,30.62 40.14,29.17 36.67,25.7 36.67,24.88 37.21,24.34 37.64,24.34 38.51,23.48 38.51,20.44 39.3,19.65 40.36,19.65 U1.29 | v53.16,46.68 51.82,48.02 51.82,48.96 H1.2 | JP12.3 30.41,35.87 30.41,38.83 31.84,40.27 31.84,45.29 v31.82,45.31
  Bottom 0.254: v31.82,45.31 32.72,45.31 33.8,44.23 34.78,44.23 38.06,47.52 52.32,47.52 v53.16,46.68 | JP12.3 29.39,34.85 37.12,34.85 v37.96,34.02
IO10*  (via drill 0.56 pad 1.07)
  Top 0.254: 60.05,29.9 60.05,29.23 60.34,28.95 U4.9 | 60.05,29.9 v60.03,29.9 | v44.04,19.03 43.86,18.85 42.52,18.85 U1.30 | 60.05,29.9 60.05,39.21 61.76,40.92 61.76,45.45 60,47.21 54.98,47.21 53.53,45.76 52.78,45.76 49.58,48.96 49.28,48.96 H1.3
  Bottom 0.254: v44.04,19.03 44.86,19.85 47.85,19.85 48.62,19.07 49.43,19.07 50.35,19.99 51.42,19.99 52.72,21.29 52.72,22.46 56.24,25.97 56.77,25.97 60.03,29.23 v60.03,29.9
IO11*  (via drill 0.56 pad 1.07)
  Top 0.254: v53.26,28.92 52.57,28.92 51.24,27.6 51.24,27.33 U1.12 | U4.10 59.52,28.3 59.11,28.7 59.11,30.28 59.54,30.7 59.54,36.8 v59.12,37.22 59.12,39 61.25,41.13 61.25,45.24 59.81,46.67 55.16,46.67 53.74,45.26 52.57,45.26 52.01,45.81 50.9,45.81 47.75,48.96 46.74,48.96 H1.4
  Bottom 0.254: v53.26,28.92 53.56,29.23 53.56,30.86 54.42,31.72 54.42,33.92 57.41,36.91 58.82,36.91 v59.12,37.22
IO12  (via drill 0.56 pad 1.07)
  Top 0.254: v43.48,21.61 42.97,21.61 42.52,22.05 U1.26 | v57.33,41.8 54.38,44.75 52.35,44.75 51.8,45.31 50.69,45.31 49.66,46.33 46.82,46.33 44.2,48.96 H1.5
  Bottom 0.254: 57.42,42.05 57.26,42.21 55.74,42.21 54.93,41.4 54.93,41.36 47.33,33.75 47.33,27.05 45.75,25.48 45.75,24.14 44.38,22.78 44.38,22.55 43.48,21.64 v43.48,21.61 | 57.42,42.05 57.42,41.9 v57.33,41.8 | 57.42,42.05 58.85,42.05 59.91,40.99 65.64,40.99 SW2.1
IO13*  (via drill 0.56 pad 1.07)
  Top 0.254: v44.94,21.81 45.02,21.74 45.02,18.66 43.61,17.25 42.52,17.25 U1.32 | v56.04,41.22 56.04,41.18 55.63,40.77 JP5.1 | U2.3 53.47,40.89 53.59,40.77 JP5.1 | H1.6 41.66,48.96 44.79,45.82 49.45,45.82 50.48,44.8 51.59,44.8 52.15,44.24 52.34,44.24 54.61,41.97 54.61,41.47 JP5.1
  Bottom 0.254: v56.04,41.22 47.83,33.01 47.83,26.84 46.51,25.52 46.51,24.17 44.94,22.6 v44.94,21.81
IO13_MIRROR  (via drill 0.56 pad 1.07)
  Top 0.254: v58.5,41.11 58.28,40.89 57.01,40.89 55.87,39.75 JP5.2 53.59,39.75 53.47,39.62 U2.2 53.89,39.62 53.89,38.35 U2.1 | v73.11,15.32 72.23,13.41 72.23,12.73 71.53,12.04 71.19,12.04 70.86,11.7 70.86,8.24 70.4,7.78 68.39,7.78 66.45,9.72 66.45,10.15 RN3.8
  Bottom 0.254: v58.5,41.11 59.12,40.48 63.28,40.48 65.29,38.47 67.42,38.47 70.08,41.13 71.89,41.13 76.25,36.77 76.25,34.49 75.89,33.73 75.89,32.97 76.07,31.6 76.07,17.67 75.81,16.91 75.81,16.9 73.82,15.32 v73.11,15.32
LED1_ANODE
  Top 0.254: RN3.1 68.4,10.15 69.06,9.5 69.06,8.76 LED1.A
LED2_ANODE
  Top 0.254: LED2.A 71.25,12.54 69.09,12.54 68.4,11.85 RN3.3
LED3_ANODE
  Top 0.254: RN3.4 67.98,13.28 67.98,13.32 LED3.A
LED4_ANODE
  Top 0.254: LED4.A 68.53,10.92 68.4,11.05 RN3.2
LED5_CATHODE
  Top 0.254: R3.1 64.42,30.48 64.41,30.47
  Top 0.406: LED5.C 64.41,30.47
LIGHT  (via drill 0.56 pad 1.07)
  Top 0.254: v55.73,37.24 56.03,37.54 56.03,38.47 57.25,39.68 59.09,39.68 60.34,40.93 v60.34,44.73 | v69.11,38.1 68.23,38.99 68.23,40.33 64.22,44.34 v63.69,44.34 | v43.2,43.54 43.2,41.05 RN4.4 | C11.2 52.35,36.2 52.41,36.25 v53.44,36.25 | JP8.1 76.2,17.91 Q1.K 72,20.07 v71.15,20.83
  Bottom 0.254: v43.2,43.54 44.95,45.29 51.81,45.29 52.35,44.75 53.95,44.75 54.47,45.26 57.7,45.26 59.16,46.72 59.77,46.72 60.38,46.11 60.38,44.77 v60.34,44.73 63.29,44.73 v63.69,44.34 | v69.11,38.1 67.75,36.73 67.87,33.93 68.58,33.53 71.12,33.53 75.06,31.29 75.06,21.39 v71.15,20.83 | v55.73,37.24 54.74,36.25 v53.44,36.25
MIC_IN
  Top 0.254: RN2.2 35.46,30.59 35.84,30.97 35.84,37.04 35.24,37.65 35.24,38.72 | C7.1 41.5,42.29 40.3,42.29 37.08,39.07 35.6,39.07 35.24,38.72 | MIC1.1 34.98,38.72 35.24,38.72
MISO  (via drill 0.56 pad 1.07)
  Top 0.254: v48.15,23.08 48.39,23.32 50.88,23.32 51.96,24.4 51.96,24.45 52.64,24.45 U1.11
  Bottom 0.254: H5.1 60.05,38.35 58.73,39.68 57.24,39.68 56.46,38.9 56.46,37.8 56.65,37.62 56.65,36.86 53.91,34.13 53.91,31.93 53.05,31.07 53.05,30.02 48.93,25.89 48.93,23.86 v48.15,23.08
MOSI  (via drill 0.56 pad 1.07)
  Top 0.254: v49.98,22.41 50.36,22.79 51.11,22.79 51.96,23.65 U1.10
  Bottom 0.254: v49.98,22.41 49.98,21.86 50.87,20.96 51.68,20.96 52.21,21.5 52.21,25.87 54.68,28.33 54.68,29.52 54.63,29.57 54.63,30.49 55.44,31.3 55.44,33.5 57.63,35.69 58.66,35.69 59.69,34.65 61.7,34.65 62.59,35.54 62.59,35.81 H5.4
MOTL+
  Top 0.254: 68.89,28.65 68.36,28.3 U4.7
  Top 0.813: J7.2 68.89,28.65
MOTL-
  Top 0.254: U4.5 71.23,27
  Top 0.406: 71.23,27 72.75,27.43
  Top 0.813: 72.75,27.43 73.66,29.02 J7.1
MOTR+
  Top 0.254: 69.03,24.81 68.18,25.05 67.48,25.05 U4.2
  Top 0.813: 69.03,24.81 69.84,24.1 J6.1
MOTR-
  Top 0.254: 70.71,26.34 U4.4
  Top 0.406: 72.53,25.94 70.71,26.34
  Top 0.813: J6.2 72.53,25.94
OPAMP1_M  (via drill 0.56 pad 1.07)
  Top 0.254: U2.6 48.65,40.89 48.86,40.89 v49.06,41.09 | R2.2 45.56,36.2 45.17,36.2 v44.02,37.34 | RN4.6 41.25,40.15 40.81,40.15 v40.76,40.2
  Bottom 0.254: v44.02,37.34 44.02,37.54 | 44.02,37.54 41.35,40.2 v40.76,40.2 | 44.02,37.54 47.57,41.09 v49.06,41.09
OPAMP1_OUT  (via drill 0.56 pad 1.07)
  Top 0.254: U2.7 46.55,39.62 45.68,39.62 45.16,40.15 RN4.3 43.2,40.15 43.2,37.85 v42.68,37.33
  Bottom 0.254: D1.A 38.55,41.09 42.31,37.33 v42.68,37.33
OPAMP1_P  (via drill 0.56 pad 1.07)
  Top 0.254: v32.76,42.54 32.59,42.38 32.59,40.3 31.08,38.79 31.08,31.9 31.6,31.39 RN2.6 | U2.5 44.99,42.16 44.86,42.29 44.47,42.29 | C7.2 44.47,42.29 | v41.48,43.62 42.35,44.48 43.6,44.48 44.47,43.62 44.47,42.29 | v41.12,45.48 41.02,45.58 v39.8,45.58
  Bottom 0.254: v32.76,42.54 35.24,42.54 38.29,45.58 v39.8,45.58 | v41.48,43.62 41.12,43.98 v41.12,45.48
RD_M  (via drill 0.56 pad 1.07)
  Top 0.254: v51.15,18.06 51.16,18.05 51.96,18.05 U1.3 | v36.59,18.62 36.02,18.05 35.46,18.05 RN1.3
  Bottom 0.254: v36.59,18.62 37.93,19.96 40.53,19.96 41.96,18.53 41.96,18.31 43.23,17.03 44.78,17.03 46.04,18.3 47.24,18.3 48.02,17.52 50.61,17.52 v51.15,18.06
RD_P  (via drill 0.56 pad 1.07)
  Top 0.254: v54.74,18.77 54.2,18.77 54.12,18.85 U1.4 | RN1.4 35.46,18.95 36.12,19.61 36.94,19.61 38.1,18.45 38.1,16.8 v38.98,15.5
  Bottom 0.254: v38.98,15.5 38.61,16.48 38.61,17.9 39.14,18.43 39.9,18.43 40.44,17.9 40.44,17.68 42.86,15.25 51.42,15.25 54.74,18.57 v54.74,18.77
RESET  (via drill 0.56 pad 1.07)
  Top 0.254: 46.53,5.29 v46.78,5.33 | v47.93,24.73 47.04,23.84 43.07,23.84 42.58,24.34 42.58,27.45 v42.87,27.74 | v55.55,29.95 52.58,29.95 50.44,27.81 50.44,27.33 U1.13 50.44,25.17 50.44,24.91 v50.28,24.75 | SW1.1 28.93,25.58 32.29,28.93 33.22,28.93 33.55,29.26 33.55,29.69 34.1,29.69 RN2.1 35.46,29.69 39.13,29.69 v39.22,29.78 | v19.45,15.95 21.97,18.47 21.97,21.08 v23.5,22.6
  Top 0.406: 46.53,5.29 45.72,4.38 H3.3
  Bottom 0.254: v46.78,5.33 45.16,5.94 43.74,5.94 43,5.21 40.73,5.21 39.95,6 38.48,6.1 38.23,6.73 21.08,6.73 21,6.76 16.04,9.3 16.04,12.54 v19.45,15.95 | v39.22,29.78 40.82,29.78 v42.87,27.74 | v50.28,24.75 50.28,24.01 49.06,22.79 49.06,22.67 48.56,22.17 47.77,22.17 47.23,22.7 47.23,23.46 47.93,24.15 v47.93,24.73 | 59.03,33.27 59.03,31.98 D2.A | v55.55,29.95 55.95,30.34 55.95,33.29 57.81,35.15 58.46,35.15 59.03,34.58 59.03,33.27 | 59.03,33.27 60.05,33.27 60.63,33.27 H5.5 | SW1.1 27.56,24.19 27.56,22.88 25.77,21 24.94,21 23.5,22.44 v23.5,22.6
RXLED  (via drill 0.56 pad 1.07)
  Top 0.254: LED3.C 68.96,15.44 66.3,18.11 66.3,19.83 67.4,20.93 v67.93,20.93 | v67.93,20.93 | U1.8 53.89,22.05 55.08,22.05 v55.99,22.96
  Bottom 0.254: v67.93,20.93 67.12,20.93 65.97,19.28 65.02,17.65 60.55,17.65 59.42,18.81 59.42,19.53 v55.99,22.96
SCK  (via drill 0.56 pad 1.07)
  Top 0.254: U1.9 51.96,22.85 51.3,22.18 v51.3,21.88
  Bottom 0.254: H5.3 60.05,35.81 59.63,36.24 57.46,36.24 54.93,33.71 54.93,31.51 54.12,30.7 54.12,29.35 54.17,29.3 54.17,28.55 51.3,25.67 v51.3,21.88
SLIDER
  Bottom 0.406: JP9.1 P1.2
SOUND
  Top 0.254: JP7.1 45.47,39 45.11,39.35 RN4.2 | D1.C 48.26,43.94 48.39,43.81 C10.2
  Bottom 0.254: D1.C 47.51,43.94 49.98,41.47 49.98,40.72 46.73,37.47 JP7.1
TXLED  (via drill 0.56 pad 1.07)
  Top 0.254: v64.35,8.32 63.27,9.25 v54.3,9.25 | v67.62,14.34 68.07,14.22 71.25,14.34 LED2.C | U1.22 43.24,25.17 43.24,25.03 v43.52,24.76 | v27.9,33.42 27.9,29.89 v26.87,28.86 | v19.4,14.11 22.48,17.19 22.48,20.81 23.36,21.69 25.17,21.69 v25.39,21.91 | v40.91,27.28 41.17,27.55 41.17,33.8 v41.01,33.96
  Bottom 0.254: v54.3,9.25 52.62,7.54 42.8,7.54 42.04,8.33 39.13,8.33 38.68,7.88 24.36,7.88 22.29,9.95 22.29,12.8 20.98,14.11 v19.4,14.11 | v25.39,21.91 25.48,21.91 26.89,23.58 27.14,26.63 27.68,27.17 27.68,28.05 v26.87,28.86 | v41.01,33.96 40.16,33.1 37.58,33.1 36.35,34.34 30.82,34.34 29.8,33.31 28,33.31 v27.9,33.42 | v40.91,27.28 40.99,27.28 v43.52,24.76 | v67.62,14.34 v64.35,8.32
U3_CONT
  Top 0.254: U3.1 65.51,18.68 65.52,18.68 L3.2
U4_AISEN
  Top 0.254: 70.24,25.7 U4.3
  Top 0.406: 71.67,22.32 71.67,24.67 70.24,25.7 | RN7.4 RN7.3
  Top 0.61: 75.47,28.93 76.19,29.52 76.83,29.61 RN7.4 | 72.36,21.22 71.67,22.32
  Top 0.813: 75.47,28.93 75.47,22.07 74.63,21.22 72.36,21.22
U4_BISEN
  Top 0.254: 69.72,27.64 U4.6
  Top 0.406: RN7.1 RN7.2 76.81,31.24 76.52,32.14 | 72.48,32.14 71.75,30.8 71.75,29.68 69.72,27.64
  Top 0.813: 76.52,32.14 72.48,32.14
U4_NFAULT
  Top 0.254: 66.43,29.99 66.43,30.08 66.83,30.48 67.22,30.48 67.64,30.07 67.64,29.1 67.48,28.95 U4.8 | R3.2 66.43,29.99 | 66.43,29.99 66.42,30
  Top 0.305: 66.42,30 JP1.1
U4_NSLEEP  (via drill 0.56 pad 1.07)
  Top 0.254: U4.1 67.48,24.39 67.48,22.67 68.85,21.31 68.85,20.55 67.7,19.4 v67.21,19.4 | RN5.7 33.55,22.24 33.55,15.92 32.65,15.02 v32.09,15.02
  Top 0.406: RN5.8 RN5.7
  Bottom 0.254: v67.21,19.4 66.6,18.79 65.41,17.14 60.33,17.14 59.69,17.78 58.68,18.79 56.95,18.79 51.68,13.52 34.63,13.52 33.13,15.02 v32.09,15.02
U4_VCP
  Top 0.254: U4.11 58.98,27.64 58.57,28.06 57.78,28.06 C15.1
U4_VINT
  Top 0.254: U4.14 59.36,25.7 58.57,24.9 57.78,24.9 C12.1
U5_ANODE  (via drill 0.56 pad 1.07)
  Top 0.254: RN6.8 35.46,27.71 35.82,28.07 v35.82,28.62
  Bottom 0.203: U5.1
  Bottom 0.254: U5.1 35.03,29.42 v35.82,28.62
U5_COLLECTOR  (via drill 0.56 pad 1.07)
  Top 0.254: RN5.6 34.53,21.48 35.44,21.48 37.24,23.27 v37.24,23.43
  Bottom 0.203: U5.3
  Bottom 0.254: U5.3 | U5.3 33.3,32.18 34.19,33.07 35.73,33.07 36.78,32.02 36.78,28.44 38.12,27.1 38.12,26.09 38.51,25.69 38.51,24.96 37.24,23.68 v37.24,23.43 | v37.24,23.43 | JP10.2 30.15,32.13 30.2,32.18 30.76,32.18 U5.3
U6_ANODE  (via drill 0.56 pad 1.07)
  Top 0.254: RN6.7 35.46,26.82 35.48,26.8 v35.88,26.8
  Bottom 0.203: U6.1
  Bottom 0.254: U6.1 30.43,23.84 32.92,23.84 v35.88,26.8
U6_COLLECTOR
  Top 0.254: JP11.VIA6 35.48,20.57 35.46,20.55 RN5.5
  Bottom 0.203: U6.3 34.34,21.16
  Bottom 0.254: JP11.VIA6 35.26,21.1 35.26,21.16 34.34,21.16 U6.3
UCAP
  Top 0.254: C9.1 56.26,20.69 56.04,20.47 54.53,20.47 54.48,20.42 54.15,20.42 54.12,20.45 U1.6
UGND  (via drill 0.56 pad 1.07)
  Top 0.254: v58.14,17.87 58.04,17.97 58.04,18.99 JP4.2 57.25,19.68 57.24,19.67 C9.2 55.28,19.67 55.24,19.71 54.19,19.71 54.12,19.65 53.59,19.65 U1.5 | v14.42,16.1 14.42,9.58 14.59,9.49 v19.81,5.97 | v37.38,9.42 37.38,6.01 v33.02,5.84 | L2.1 16.3,21.96 17.26,22.93 v17.33,22.93 17.92,23.52 17.92,29.04 17.7,29.26 17.09,29.67
  Top 0.406: X2.GND 22.86,43.71 22.86,43.18 22.86,43.05 21.89,42.09 21.26,41.91 21.26,37.21 v21.56,37.04 | v17.09,30.4 17.09,29.67
  Top 0.61: X1.GND 13.96,25.47 14.3,29.67 17.09,29.67
  Bottom 0.254: 19.65,32.82 X3.GND_VIA 19.51,32.82 | v58.14,17.87 57.58,17.87 48.28,8.61 44.02,8.61 43.25,9.5 38.1,9.5 37.4,9.35 v37.38,9.42 | v17.33,22.93 17.33,19.01 v14.42,16.1 | v33.02,5.84 v19.81,5.97
  Bottom 0.406: 19.65,32.82 20.96,34.13 20.96,36.44 v21.56,37.04 | v17.09,30.4 19.51,32.82
VCCIO  (via drill 0.56 pad 1.07)
  Top 0.254: 61.77,13.02 61.72,13.07 61.72,13 | 63.14,21.83 C14.1 | L3.1 63.52,20.76 | 58.81,27 58.77,27.04 | v30.69,25.91 | 61.72,12.93 61.72,13 | 61.72,13 61.54,13 | 24.83,30.56 v24.83,30.52 | 61.95,22.51 61.81,22.51 | v23.39,20.42 23,20.02 23,14.37
  Top 0.305: U4.12 58.81,27 | LED5.A 61.83,31.67 v62.02,31.86
  Top 0.406: 61.77,13.02 62.51,13.02 U3.4 62.51,15.28 61.6,15.99 61.6,19.04 63.52,20.76 63.52,21.45 63.14,21.83 | 58.77,27.04 C15.2 56.8,27.04 56.55,27.04 v56.4,26.89 | 61.72,12.93 61.72,12.56 D4.C | C14.1 61.95,22.51 | v30.69,25.91 31.6,26.82 RN6.2 RN6.1 | v30.69,25.91 30.69,24.04 31.6,23.14 RN5.1 RN5.2 | 61.54,13 v61.04,13.5 | 61.81,22.51 v61.53,22.78 | 23,14.37 v24.9,12.46 | L3.1 63.04,20.07
  Top 0.61: 24.83,30.56 25.26,30.99 D3.C 26.28,32.1 26.28,34.28 JP12.2
  Top 1.422: 63.04,20.34 63.04,20.07 63.04,19.79
  Bottom 0.254: 25.91,20.42 28.12,22.67 | 28.75,24.12 29.52,24.12 | 30.69,25.35 v30.69,25.91 | v24.9,12.46
  Bottom 0.406: v61.04,13.5 60.2,14.35 54.88,14.35 48.62,8.08 43.04,8.08 42.27,8.91 38.92,8.91 38.47,8.48 27.38,8.48 24.9,10.87 v24.9,12.46 | 59.7,31.06 59.08,30.28 58.88,29.4 | 29.46,28.65 27.19,29.84 25.51,29.84 v24.83,30.52 | v23.39,20.42 25.91,20.42 | 28.12,22.67 28.12,23.48 28.75,24.12 | 29.52,24.12 30.69,25.35
  Bottom 0.61: 59.7,31.06 61.02,31.06 v62.02,31.86 | 58.88,29.4 v56.4,26.89 | v30.69,25.91 30.69,26.33 29.46,28.65
  Bottom 0.813: v61.53,22.78 61.02,23.3 61.02,23.88 58.67,25.91 58.67,26.67 61.72,29.72 61.72,30.99 v62.02,31.86
VIN  (via drill 0.56 pad 1.07)
  Top 1.016: D4.A 58.9,7.76 v58.63,8.02
  Bottom 0.254: 58.42,8.02 v58.63,8.02
  Bottom 1.016: H3.8 58.42,8.02 J5.1
VUSB  (via drill 0.56 pad 1.07)
  Top 0.254: v46.58,16.82 46.31,17.1 46.31,20.77 47.04,21.5 49.95,21.5 50.5,20.94 51.66,20.94 51.96,21.25 U1.7 | D3.A 21.98,29.87 22.23,29.63 JP6.1 21.82,27.79 21.82,27.18 F1.1 20.49,25.1 22.08,25.1 v22.17,25
  Bottom 0.254: v22.17,25 21.89,24.71 21.89,14.22 22.58,13.53 26.19,13.53 28.6,15.94 32.93,15.94 34.75,14.12 37.87,14.12 38.1,14.35 38.1,18.13 38.91,18.94 40.11,18.94 40.95,18.11 40.95,17.89 42.84,16 45.76,16 v46.58,16.82
XTAL1
  Top 0.254: U1.17 47.24,28.15 45.17,30.23 Y1.2 45.03,30.3 45.03,32.36 44.59,32.8 C2.1 R1.1
XTAL2
  Top 0.254: R1.2 49.18,33.78 50.26,33.78 | U1.16 48.04,27.33 48.04,28.71 49.55,30.23 Y1.1 50.26,30.45 50.26,33.78 | C1.2 50.26,33.78
XUSB  (via drill 0.56 pad 1.07)
  Top 0.254: F1.2 16.59,24.92 v16.35,24.67
  Top 0.61: X1.5V 9.01,18.47 v13.37,18.43
  Bottom 0.254: 21.29,39.32 X3.VBUS_VIA | v16.35,24.67 16.93,24.67 18.46,23.14 19.22,23.14 19.76,23.68 19.76,24.25 22.23,26.73 22.23,35.7 22.99,36.45 22.99,37.63 21.29,39.32 | 21.29,39.32 22.06,40.09 22.1,41.02 23.5,42.42 23.5,42.55 23.5,46.35 22.98,46.87 22.06,46.87 X2.VBUS | v13.37,18.43 13.66,18.43
  Bottom 0.61: 13.66,18.43 14.63,23.57 v16.35,24.67
(copper drawn outside any net)
  shapes: Bottom area x3, Route15 area x2, Route2 area x2, Top area x2

## Text on the board
Top: v8 | CSA
Bottom: v8 | CSA
tPlace: XOrduino! | 1 | 0 | Break off | & glue to | bottom of | center tab | 13 | 12 | 11 | 10 | 9 | 8 | 7 | 6 | 5 | 4 | 3 | 2 | # | # | SCL | SDA | # | # | # | X2 | GND | # | # | DIGITAL | AREF | C10 | SW3 | D1 | [#=PWM] | USER | C7 | H5 | ICSP | X3 | MIC1 | RN4 | 1 | SW2 | 104 | U2 | JP5 | P1 | R2 | C11 | BLACK | RED | OTHER | C2 | R1 | C1 | JP1 | SERVO | D2 | + | - | SOUND | FAULT | D3 | R3 | + | - | RN7 | RN2 | 103 | Y1 | 1.0 | C15 | F1 | JP6 | C5 | J7 | RN6 | 221 | C4 | C12 | J6 | SW1 | U4 | Z1 | C14 | 2012-08-02 v8 | Q1 | RN5 | 104 | C9 | L2 | L3 | + | - | Z2 | U1 | C13 | + | - | LIGHT | RN1 | 220 | RESET | L1 | U3 | RX | JP2 | C8 | J5 Batt | TX | J1 | J3 | C3 | ON | C6 | RN3 | 102 | D4 | SW4 | - | + | PIN13 | A | B | C | D | ANALOG | IOREF | RST | 3V3 | 5V | GND | GND | VIN | A0 | A1 | A2 | A3 | A4 | A5 | Break off | & glue to | bottom of | center tab
bPlace: OLPC-F | o | Cut JP2 if populating L1 | Cut JP5 if populating U2 | X | Cut JP6 if populating U3 | JP9 | JP7 | + | - | U5 | JP10 | Speed | Sensors | Motors | Front Skid | U6 | + | - | Bottom | JP11 | J2 | J4 | - | + | 4.5v | A | B | C | D | Battery | JP8
tNames: PWM COMPL1 | PWM COMPL2 | SCL | SDA | A11 | A10 | A9 | A8 | (AIN0) | A7 | A6 | M.Banzi | D.Cuartielles | T.Igoe | G.Martino | D.Mellis | C. Scott Ananian
tDocu: XOrduino! | TX1 | RX1 | Alt Routing for LIGHT/A5 | IN